# Altium schematic sheet Sheet1.SchDoc
size A3; SheetNumber: 12; SheetTotal: 12
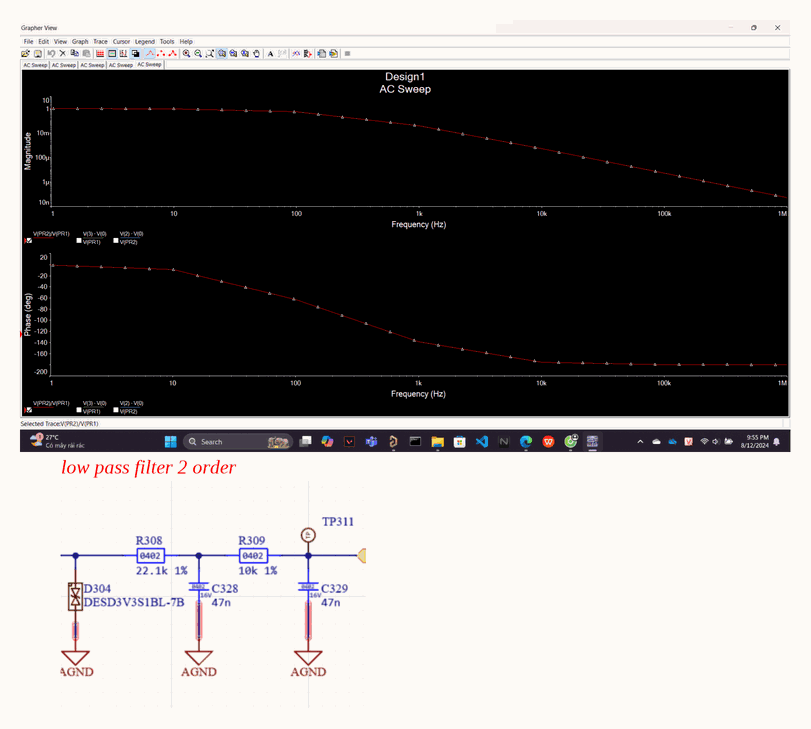
[diagram p0: Sheet1.SchDoc]

## Notes on the sheet
- low pass filter 2 order